# Altium schematic sheet power_protection.SchDoc
size A4
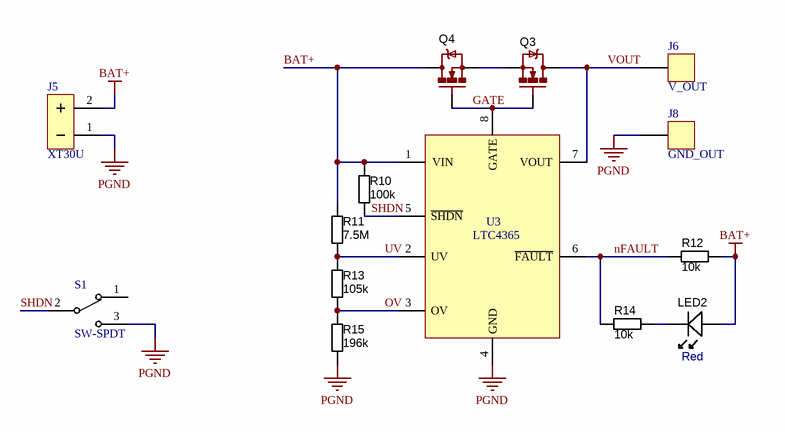
[diagram p0: power_protection.SchDoc]

## Parts
J5  XT30U  [XT30U-PCB-LA-CUTOUT]
J6  V_OUT  [POWER-PAD]
J8  GND_OUT  [POWER-PAD]
LED2  Red  [LED-0603-GREEN]
Q3  MOSFET-N  [SOT669]  (value not drawn)
Q4  MOSFET-N  [SOT669]  (value not drawn)
R10  100k  [RESC1608X55N]
R11  7.5M  [RESC1608X55N]
R12  10k  [RESC1608X55N]
R13  105k  [RESC1608X55N]
R14  10k  [RESC1608X55N]
R15  196k  [RESC1608X55N]
S1  SW-SPDT  [A12AP-PCB-CUTOUT]
U3  LTC4365  [SOT23-8]

## Nets
BAT+: J5.2(+) LED2.A Q4.D R10.2 R11.2 R12.2 U3.1(VIN)
PGND: J5.1(-) J8.1 R15.1 S1.3 U3.4(GND)
GATE: Q3.G Q4.G U3.8(GATE)
nFAULT: R12.1 R14.1 U3.6(~{FAULT})
OV: R13.1 R15.2 U3.3(OV)
SHDN: R10.1 S1.2 U3.5(~{SHDN})
UV: R11.1 R13.2 U3.2(UV)
VOUT: J6.1 Q3.D U3.7(VOUT)
NetLED2_K: LED2.K R14.2
NetQ3_S: Q3.S Q4.S

Not connected (* = marked no-connect by the designer): S1 1

## Notes on the sheet
- Size:
- Date:
- A4
- Sheet
- Drawn by:
- of
- Revision:
- SmartStuff OÜ
- Näituse 26
- 50407 Tartu
- Estonia
- File name:

## Library data of the parts
J6 J8 = HEADER-1
LED2 = LED_SMD_Green_0603_525nm_350mcd: LED 0603 SMD Green 525nm 350mcd 20mA; Manufacturer 1: Kingbright; Manufacturer Part Number 1: APT1608ZGCK; Material: InGaN; Ratings: 200mcd min; 350 mcd typ @ 20mA; Voltage - Forward (Vf) @ 10mA: 3.1V; Viewing Angle: 120°; Lens Style/Size: Rectangle with Flat Top, 1.2mm x 0.8mm; Voltage - Forward (Vf) @ 20mA: 3.3V; SCDType: source; Package / Case: 0603 (1608 metric); Color: Green; Current - Test: 20mA; Manufacturer 2: Kingbright Company LLC; Manufacturer Part Number 2: APT1608-WAP24; Supplier 1: Mouser; Supplier Part Number 1: 604-APT1608ZGCK; ComponentLink1URL: http://www.mouser.com/ds/2/216/APT1608ZGCK-262051.pdf; ComponentLink1Description: http://www.mouser.com/ds/2/216/APT1608ZGCK-262051.pdf; ComponentLink2Description: APT1608-WAP24 Datasheet; ComponentLink2URL: \\SVFI2\PBLShare\Eng\Electrical Engineering\Hardware\Altium\Libraries and Templates\Unreleased Components\Part Number Request 2013-10-02\APT1608-WAP24(Ver.1B).pdf
Q3 Q4 = MOSFET-N: PROD_ID: IC-08089
R10-R15 = RES_1K5_0603_5%: Resistor SMD chip 1.5k Ohm 0.1W 5% 0603; Manufacturer 1: Yageo; Manufacturer Part Number 1: RC0603JR-071K5L; Ratings: 1/10 W; Value: 1K5; SCDType: spec; Package / Case: 0603 (1608 metric); Tolerance: ±5%; Material: thick film; Supplier 1: Digi-Key; Supplier Part Number 1: 311-1.5KGRCT-ND